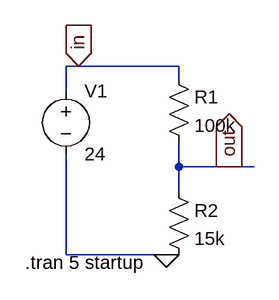
[diagram p0: schematic Draft4.asc]
Draft4.asc, the LTspice schematic file:
Version 4
SHEET 1 880 680
WIRE 48 80 32 80
WIRE 176 80 48 80
WIRE 176 96 176 80
WIRE 32 112 32 80
WIRE 176 208 176 176
WIRE 240 208 176 208
WIRE 272 208 240 208
WIRE 176 240 176 208
WIRE 32 320 32 192
WIRE 160 320 32 320
WIRE 176 320 160 320
FLAG 240 208 out
IOPIN 240 208 Out
FLAG 48 80 in
IOPIN 48 80 In
FLAG 160 320 0
SYMBOL res 160 80 R0
SYMATTR InstName R1
SYMATTR Value 100k
SYMBOL res 160 224 R0
SYMATTR InstName R2
SYMATTR Value 15k
SYMBOL voltage 32 96 R0
WINDOW 123 0 0 Left 0
WINDOW 39 0 0 Left 0
SYMATTR InstName V1
SYMATTR Value 24
TEXT -20 330 Left 2 !.tran 5 startup

The netlist it stands for:
* Draft4.asc
R1 in out 100k
R2 out 0 15k
V1 in 0 24
.tran 5 startup
.backanno
.end

* Results of the author's LTspice run, read from the files saved beside the schematic
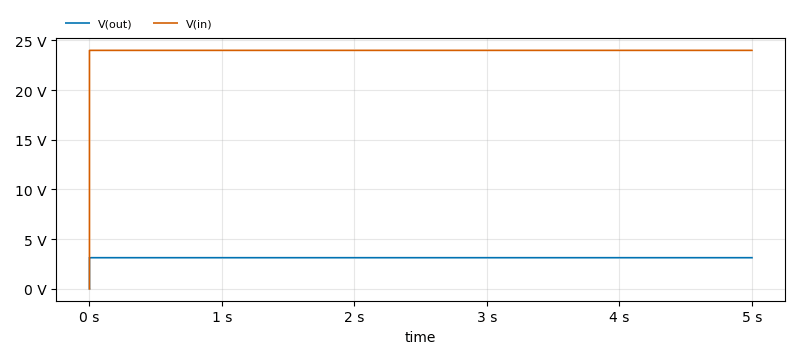
[diagram p1: Transient Analysis of Draft4.asc, plotted from the saved traces]
* Transient Analysis, 1 run:
*   V(out): min 0 V, max 3.13 V, average 3.13 V, rms 3.13 V, last 3.13 V
*   V(in): min 0 V, max 24 V, average 24 V, rms 24 V, last 24 V